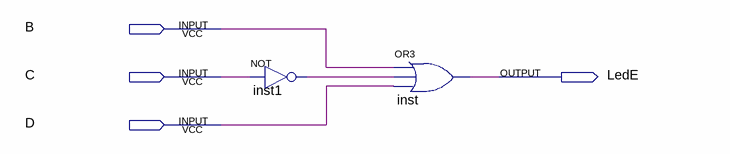
[diagram p0: schematic sheet]
// Quartus schematic LEDbcdE.bdf as structural Verilog: 2 symbols, 4 pins
module LEDbcdE (
  input  B,
  input  C,
  input  D,
  output LedE
);

  wire inst1_out;

  not inst1 (inst1_out, C);
  or inst (LedE, B, inst1_out, D);
endmodule
